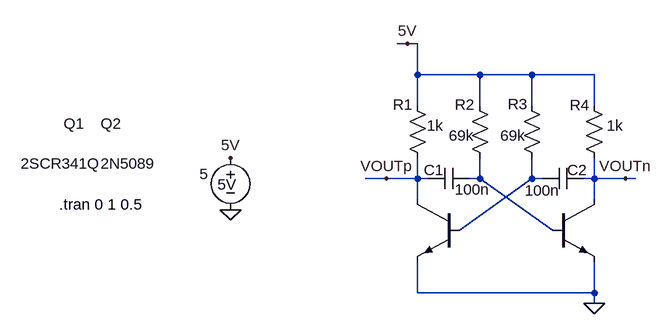
[diagram p0: schematic Square Oscillator BJT.asc]
Square Oscillator BJT.asc, the LTspice schematic file:
Version 4
SHEET 1 3572 1320
WIRE 640 144 624 144
WIRE 656 144 640 144
WIRE 656 192 656 144
WIRE 752 192 656 192
WIRE 832 192 752 192
WIRE 928 192 832 192
WIRE 656 240 656 192
WIRE 752 240 752 192
WIRE 832 240 832 192
WIRE 928 240 928 192
WIRE 608 352 576 352
WIRE 656 352 656 320
WIRE 656 352 608 352
WIRE 672 352 656 352
WIRE 752 352 752 320
WIRE 752 352 736 352
WIRE 832 352 832 320
WIRE 848 352 832 352
WIRE 928 352 928 320
WIRE 928 352 912 352
WIRE 976 352 928 352
WIRE 992 352 976 352
WIRE 656 384 656 352
WIRE 928 384 928 352
WIRE 720 432 832 352
WIRE 864 432 752 352
WIRE 656 528 656 480
WIRE 928 528 928 480
WIRE 928 528 656 528
WIRE 928 544 928 528
FLAG 368 320 5V
FLAG 368 400 0
FLAG 928 544 0
FLAG 640 144 5V
FLAG 976 352 VOUTn
FLAG 608 352 VOUTp
SYMBOL voltage 368 304 R0
WINDOW 0 -20 57 Left 2
WINDOW 3 -48 41 Left 2
WINDOW 123 0 0 Left 0
WINDOW 39 0 0 Left 0
SYMATTR InstName 5V
SYMATTR Value 5
SYMBOL res 672 336 R180
WINDOW 0 23 98 Left 2
WINDOW 3 -24 66 Left 2
SYMATTR InstName R1
SYMATTR Value 1k
SYMBOL npn 864 384 R0
WINDOW 0 -696 -117 Left 2
WINDOW 3 -696 -55 Left 2
SYMATTR InstName Q2
SYMATTR Value 2N5089
SYMBOL npn 720 384 M0
WINDOW 0 577 -117 Left 2
WINDOW 3 552 -55 Left 2
SYMATTR InstName Q1
SYMATTR Value 2SCR341Q
SYMBOL res 768 336 R180
WINDOW 0 24 98 Left 2
WINDOW 3 25 50 Left 2
SYMATTR InstName R2
SYMATTR Value 69k
SYMBOL res 848 336 R180
WINDOW 0 22 99 Left 2
WINDOW 3 26 50 Left 2
SYMATTR InstName R3
SYMATTR Value 69k
SYMBOL res 944 336 R180
WINDOW 0 23 97 Left 2
WINDOW 3 -29 66 Left 2
SYMATTR InstName R4
SYMATTR Value 1k
SYMBOL cap 736 336 R90
WINDOW 0 18 55 VBottom 2
WINDOW 3 17 -4 VTop 2
SYMATTR InstName C1
SYMATTR Value 100n
SYMBOL cap 912 336 R90
WINDOW 0 18 10 VBottom 2
WINDOW 3 19 64 VTop 2
SYMATTR InstName C2
SYMATTR Value 100n
TEXT 104 392 Left 2 !.tran 0 1 0.5

The netlist it stands for:
* Square Oscillator BJT.asc
V§5V 5V 0 5
R1 VOUTp 5V 1k
Q2 VOUTn N001 0 0 2N5089
Q1 VOUTp N002 0 0 2SCR341Q
R2 N001 5V 69k
R3 N002 5V 69k
R4 VOUTn 5V 1k
C1 N001 VOUTp 100n
C2 VOUTn N002 100n
.model NPN NPN
.model PNP PNP
.lib standard.bjt
.tran 0 1 0.5
.backanno
.end